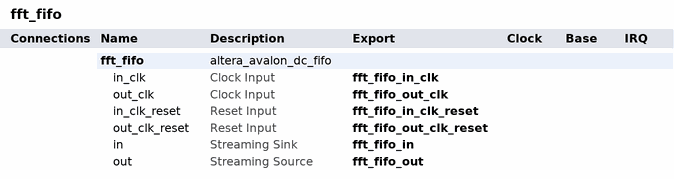
[diagram p0: system contents]
# Platform Designer (Qsys) system fft_fifo, Cyclone V 5CSEMA5F31C6
# Parameters at their usual value, and those the tool derives, are not listed.
package require -exact qsys 18.1
create_system fft_fifo
set_project_property DEVICE_FAMILY {Cyclone V}
set_project_property DEVICE 5CSEMA5F31C6

add_instance fft_fifo altera_avalon_dc_fifo 18.1
set_instance_parameter_value fft_fifo BITS_PER_SYMBOL 15
set_instance_parameter_value fft_fifo FIFO_DEPTH 1024
set_instance_parameter_value fft_fifo USE_PACKETS 1

# exported interfaces
add_interface fft_fifo_in avalon_streaming sink
set_interface_property fft_fifo_in EXPORT_OF fft_fifo.in
add_interface fft_fifo_in_clk clock sink
set_interface_property fft_fifo_in_clk EXPORT_OF fft_fifo.in_clk
add_interface fft_fifo_in_clk_reset reset sink
set_interface_property fft_fifo_in_clk_reset EXPORT_OF fft_fifo.in_clk_reset
add_interface fft_fifo_out avalon_streaming source
set_interface_property fft_fifo_out EXPORT_OF fft_fifo.out
add_interface fft_fifo_out_clk clock sink
set_interface_property fft_fifo_out_clk EXPORT_OF fft_fifo.out_clk
add_interface fft_fifo_out_clk_reset reset sink
set_interface_property fft_fifo_out_clk_reset EXPORT_OF fft_fifo.out_clk_reset

set_interconnect_requirement {$system} qsys_mm.clockCrossingAdapter HANDSHAKE
set_interconnect_requirement {$system} qsys_mm.enableEccProtection FALSE
set_interconnect_requirement {$system} qsys_mm.insertDefaultSlave FALSE
set_interconnect_requirement {$system} qsys_mm.maxAdditionalLatency 1

save_system fft_fifo.qsys
